# Altium schematic sheet Regulator3V3.SchDoc
size A; SheetNumber: 8; SheetTotal: 8
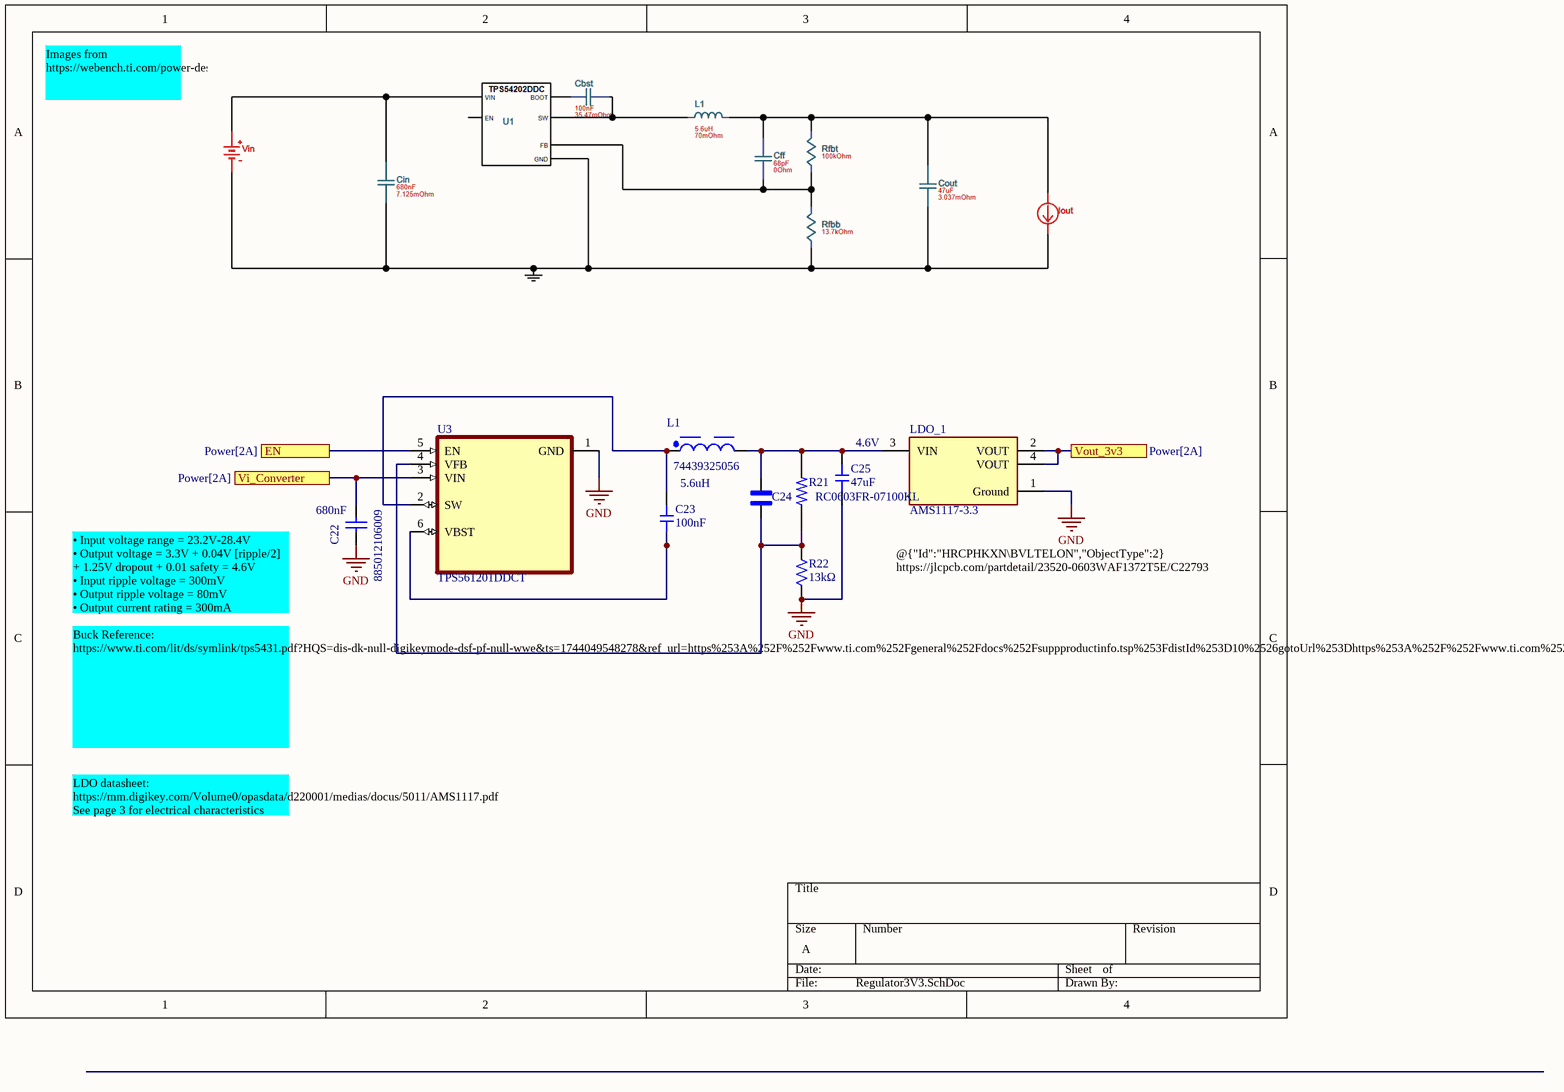
[diagram p0: Regulator3V3.SchDoc]

## Parts
C22  885012106009  Capacitance: 680nF  [WCAP-CSGP_0603_L1.6W0.8H0.8_Reflow]
C23  Capacitance: 100nF  [CAP-0402]  (hidden comment: CL05B104KO5NNNC)
C24  CGA1A2C0G1E680J030BA  [CAPC0603X33N]  (value not drawn)
C25  Capacitance: 47uF  [CAP-0805]  (hidden comment: CL21A476MQYNNNE)
L1  74439325056  Parameter 1: 5.6uH  [WE-XHMI_4040]
LDO_1  AMS1117-3.3  [FP-AMS1117-IPC_C]
R21  RC0603FR-07100KL  [RESC1607X60N]
R22  Resistance: 13kΩ  [RES-0603]  (hidden comment: 0603WAF1302T5E)
U3  TPS561201DDCT  [SOT95P280X110-6N]

## Ports
EN (see Power[2A]), Vi_Converter (see Power[2A]), Vout_3v3 (see Power[2A])

## Nets
GND: C22.1 C25.1 LDO_1.1(Ground) R22.1 U3.1(GND)
EN: U3.5(EN) ; port EN
Vi_Converter: C22.2 U3.3(VIN) ; port Vi_Converter
Vout_3v3: LDO_1.2(VOUT) LDO_1.4(VOUT) ; port Vout_3v3
NetC23_1: C23.1 U3.6(VBST)
NetC23_2: C23.2 L1.1 U3.2(SW)
NetC24_1: C24.1 R21.1 R22.2 U3.4(VFB)
NetC24_2: C24.2 C25.2 L1.2 LDO_1.3(VIN) R21.2

## Notes on the sheet
- Images from
  https://webench.ti.com/power-designer/switching-regulator?powerSupply=0
- 4.6V
- • Input voltage range = 23.2V-28.4V
  • Output voltage = 3.3V + 0.04V [ripple/2] + 1.25V dropout + 0.01 safety = 4.6V
  • Input ripple voltage = 300mV
  • Output ripple voltage = 80mV
  • Output current rating = 300mA
  • Operating frequency = 500kHz
- @{"Id":"HRCPHKXN\BVLTELON","ObjectType":2}
  https://jlcpcb.com/partdetail/23520-0603WAF1372T5E/C22793
- Buck Reference:
  https://www.ti.com/lit/ds/symlink/tps5431.pdf?HQS=dis-dk-null-digikeymode-dsf-pf-null-wwe&ts=1744049548278&ref_url=https%253A%252F%252Fwww.ti.com%252Fgeneral%252Fdocs%252Fsuppproductinfo.tsp%253FdistId%253D10%2526gotoUrl%253Dhttps%253A%252F%252Fwww.ti.com%252Flit%252Fgpn%252Ftps5431
- LDO datasheet:
  https://mm.digikey.com/Volume0/opasdata/d220001/medias/docus/5011/AMS1117.pdf
  See page 3 for electrical characteristics

## Library data of the parts
C22 = CMP-03913-53914714-2: Cap Cer 0.68UF 10V X5R 0603; Tolerance: 20%; Insulation Resistance: 200MΩ; Width: 800µm; Case Code (Imperial): 0603; Min Operating Temperature: -55°C; Mount: Surface Mount; Dielectric: X5R; Max Operating Temperature: 85°C; Length: 1.6mm; Height: 800µm; Thickness: 939.8µm; RoHS: Compliant; Packaging: Tape & Reel (TR); Voltage Rating (DC): 10V; Case Code (Metric): 1608; Case/Package: 0603; Voltage Rating: 10V
C23 = CL05B104KO5NNNC: Capacitor, Ceramic (MLCC), 100nF, ±10%, 16V, X7R, ±10%, SMD 0402; Manufacturer: Samsung Electro-Mechanics; Temperature Rating: -55°C ~ 125°C; Capacitance @ 1V DC Bias: 104.721nF; Capacitance @ 1.2V DC Bias: 104.598nF; Capacitance @ 1.35V DC Bias: 104.495nF; Capacitance @ 1.5V DC Bias: 104.372nF; Capacitance @ 1.8V DC Bias: 104.042nF; Capacitance @ 2.5V DC Bias: 102.634nF; Capacitance @ 3.3V DC Bias: 100.452nF; Capacitance @ 3.7V DC Bias: 99.160nF; Capacitance @ 4.2V DC Bias: 97.441nF; Capacitance @ 5V DC Bias: 94.577nF; Capacitance @ 9V DC Bias: 78.638nF; Capacitance @ 12V DC Bias: 66.291nF; Capacitance @ 15V DC Bias: 54.779nF; Impedance (0V Bias) @ 100Hz: 1.71E+04Ω; Impedance (0V Bias) @ 500Hz: 3.48E+03Ω; Impedance (0V Bias) @ 1kHz: 1.75E+03Ω; Impedance (0V Bias) @ 5kHz: 356Ω; Impedance (0V Bias) @ 10kHz: 179Ω; Impedance (0V Bias) @ 50kHz: 36.4Ω; Impedance (0V Bias) @ 100kHz: 18.3Ω; Impedance (0V Bias) @ 500kHz: 3.72Ω; Impedance (0V Bias) @ 1MHz: 1.87Ω; Impedance (0V Bias) @ 5MHz: 0.373Ω; Impedance (0V Bias) @ 10MHz: 0.175Ω; Impedance (0V Bias) @ 50MHz: 0.064Ω; Impedance (0V Bias) @ 100MHz: 0.122Ω; Impedance (0V Bias) @ 500MHz: 0.525Ω; Impedance (0V Bias) @ 1GHz: 0.97Ω; Impedance (0V Bias) @ 2GHz: 2.26Ω; Impedance (0V Bias) @ 5GHz: 4.75Ω; Impedance (16V Bias) @ 100Hz: 2.55E+04Ω; Impedance (16V Bias) @ 500Hz: 5.18E+03Ω; Impedance (16V Bias) @ 1kHz: 2.61E+03Ω; Impedance (16V Bias) @ 5kHz: 529Ω; Impedance (16V Bias) @ 10kHz: 266Ω; Impedance (16V Bias) @ 50kHz: 54Ω; Impedance (16V Bias) @ 100kHz: 27.2Ω; Impedance (16V Bias) @ 500kHz: 5.5Ω; Impedance (16V Bias) @ 1MHz: 2.76Ω; Impedance (16V Bias) @ 5MHz: 0.587Ω; Impedance (16V Bias) @ 10MHz: 0.277Ω; Impedance (16V Bias) @ 50MHz: 0.0412Ω; Impedance (16V Bias) @ 100MHz: 0.133Ω; Impedance (16V Bias) @ 500MHz: 0.524Ω; Impedance (16V Bias) @ 1GHz: 0.969Ω; Impedance (16V Bias) @ 2GHz: 2.25Ω; Impedance (16V Bias) @ 5GHz: 4.7Ω; Package Size: 0402; JLCPCB Basic Part: Yes; JLCPCB Part Number: C1525; Supplier 1: LCSC; Category: Capacitors - MLCC; Supplier Part Number 1: C1525; Manufacturer Part Number: CL05B104KO5NNNC; Tolerance: ±10%; Voltage Rating: 16V; Temperature Coefficient: X7R; RoHS: Yes; ComponentLink1Description: Datasheet; ComponentLink1URL: https://wmsc.lcsc.com/wmsc/upload/file/pdf/v2/lcsc/2304140030_Samsung-Electro-Mechanics-CL05B104KO5NNNC_C1525.pdf; ComponentLink2Description: JLCPCB Part URL; ComponentLink2URL: https://jlcpcb.com/partdetail/C1525; ComponentLink3Description: LCSC Part URL; ComponentLink3URL: https://lcsc.com/product-detail/Multilayer-Ceramic-Capacitors-MLCC---SMD-SMT_Samsung-Electro-Mechanics-Samsung-Electro-Mechanics-CL05B104KO5NNNC_C1525.html; ComponentLink4Description: Samsung Component Library; ComponentLink4URL: https://weblib.samsungsem.com/mlcc/mlcc-ec.do?partNumber=CL05B104KO5NNN
C24 = CGA1A2C0G1E680J030BA: 68 pF Â±5% 25V Ceramic Capacitor C0G, NP0 0201 (0603 Metric); MF: TDK; SnapEDA_Link: https://www.snapeda.com/parts/CGA1A2C0G1E680J030BA/TDK/view-part/?ref=snap; Package: 0603 Taiyo Yuden; Value: *; MP: CGA1A2C0G1E680J030BA; Check_prices: https://www.snapeda.com/parts/CGA1A2C0G1E680J030BA/TDK/view-part/?ref=eda
C25 = CL21A476MQYNNNE: Capacitor, Ceramic (MLCC), 47uF, ±20%, 6.3V, X5R, ±20%, SMD 0805; Manufacturer: Samsung Electro-Mechanics; Temperature Rating: -55°C ~ 85°C; Capacitance @ 1V DC Bias: 37.588uF; Capacitance @ 1.2V DC Bias: 35.744uF; Capacitance @ 1.35V DC Bias: 34.267uF; Capacitance @ 1.5V DC Bias: 32.775uF; Capacitance @ 1.8V DC Bias: 29.885uF; Capacitance @ 2.5V DC Bias: 24.262uF; Capacitance @ 3.3V DC Bias: 18.956uF; Capacitance @ 3.7V DC Bias: 16.988uF; Capacitance @ 4.2V DC Bias: 14.989uF; Capacitance @ 5V DC Bias: 12.411uF; Impedance (0V Bias) @ 100Hz: 51.8Ω; Impedance (0V Bias) @ 500Hz: 10.7Ω; Impedance (0V Bias) @ 1kHz: 5.39Ω; Impedance (0V Bias) @ 5kHz: 1.11Ω; Impedance (0V Bias) @ 10kHz: 0.559Ω; Impedance (0V Bias) @ 50kHz: 0.115Ω; Impedance (0V Bias) @ 100kHz: 0.0576Ω; Impedance (0V Bias) @ 500kHz: 0.00947Ω; Impedance (0V Bias) @ 1MHz: 0.00305Ω; Impedance (0V Bias) @ 5MHz: 0.0134Ω; Impedance (0V Bias) @ 10MHz: 0.0218Ω; Impedance (0V Bias) @ 50MHz: 0.0701Ω; Impedance (0V Bias) @ 100MHz: 0.113Ω; Impedance (0V Bias) @ 500MHz: 0.391Ω; Impedance (0V Bias) @ 1GHz: 0.706Ω; Impedance (0V Bias) @ 2GHz: 1.8Ω; Impedance (0V Bias) @ 5GHz: 2.67Ω; Package Size: 0805; JLCPCB Basic Part: Yes; JLCPCB Part Number: C16780; Supplier 1: LCSC; Category: Capacitors - MLCC; Supplier Part Number 1: C16780; Manufacturer Part Number: CL21A476MQYNNNE; Tolerance: ±20%; Voltage Rating: 6.3V; Temperature Coefficient: X5R; RoHS: Yes; ComponentLink1Description: Datasheet; ComponentLink1URL: https://wmsc.lcsc.com/wmsc/upload/file/pdf/v2/lcsc/2304140030_Samsung-Electro-Mechanics-CL21A476MQYNNNE_C16780.pdf; ComponentLink2Description: JLCPCB Part URL; ComponentLink2URL: https://jlcpcb.com/partdetail/C16780; ComponentLink3Description: LCSC Part URL; ComponentLink3URL: https://lcsc.com/product-detail/Multilayer-Ceramic-Capacitors-MLCC---SMD-SMT_Samsung-Electro-Mechanics-Samsung-Electro-Mechanics-CL21A476MQYNNNE_C16780.html; ComponentLink4Description: Samsung Component Library; ComponentLink4URL: https://weblib.samsungsem.com/mlcc/mlcc-ec.do?partNumber=CL21A476MQYNNN
L1 = CMP-03913-148605660-1: Power Inductor, 5.6UH, Shielded, 5.1A Rohs Compliant: Yes
LDO_1 = CMP-209535-000001-1: LDO Voltage Regulators 1A, 3.3V; Manufacturer: Advanced Monolithic Systems; Dropout Voltage: 1.1V; Output Type: Fixed; Nominal Supply Current: 5mA; Max Power Dissipation: 1.2W; Max Supply Voltage: 15V; Number Of Outputs: 1; Standoff Height: 0.64mm; Max Junction Temp: +125°C; Height: 1.8mm; Package: AMS1117; Device Class L2: Power Management ICs; ComponentLink2Description: Datasheet; ComponentLink2URL: http://www.advanced-monolithic.com/pdf/ds1117.pdf; Category: IC; RoHS: TRUE; Automotive: No; Device Class L1: Integrated Circuits (ICs); Output Current: 1A; Device Class L3: Voltage Regulators - Linear; Temperature: -40°C to +125°C; Output Voltage: 3.3V; Manufacturer Part Number: AMS1117-3.3; Temperature Range Low: -40°C; Octopart: https://octopart.com/ams1117-3.3-advanced+monolithic+systems-25899300; Lead Free: Yes; Ipc Land Pattern Name: SOT229P700X180-4; Temperature Range High: +125°C
R21 = RC0603FR-07100KL: 100 kOhms Â±1% 0.1W, 1/10W Chip Resistor 0603 (1608 Metric) Moisture Resistant Thick Film; MF: Yageo; SnapEDA_Link: https://www.snapeda.com/parts/RC0603FR-07100KL/Yageo/view-part/?ref=snap; Package: 0603 Yageo; Value: *; MP: RC0603FR-07100KL; Check_prices: https://www.snapeda.com/parts/RC0603FR-07100KL/Yageo/view-part/?ref=eda
R22 = 0603WAF1302T5E: Resistor, 13kΩ, ±1%, 100mW, 75V, ±100ppm/℃, -55℃~+155℃, SMD 0603; Manufacturer: Uniroyal; Supplier 1: LCSC; Manufacturer Part Number: 0603WAF1302T5E; Supplier Part Number 1: C22797; JLCPCB Part Number: C22797; Power Rating: 100mW; Category: Resistors; Package Size: 0603; JLCPCB Basic Part: Yes; Tolerance: ±1%; Voltage Rating: 75V; Temperature Coefficient: ±100ppm/℃; Temperature Rating: -55℃~+155℃; ComponentLink1Description: Datasheet; ComponentLink1URL: https://wmsc.lcsc.com/wmsc/upload/file/pdf/v2/lcsc/2206010130_UNI-ROYAL-Uniroyal-Elec-0603WAF1302T5E_C22797.pdf; ComponentLink2Description: JLCPCB Part URL; ComponentLink2URL: https://jlcpcb.com/partdetail/C22797
U3 = TPS561201DDCT: 4.5V to 17V Input, 1A Synchronous Step-Down Voltage Regulator in 6-pin SOT-23; MF: Texas Instruments; SnapEDA_Link: https://www.snapeda.com/parts/TPS561201DDCT/Texas+Instruments/view-part/?ref=snap; Package: SOT-23-THN-6 Texas Instruments; Value: *; MP: TPS561201DDCT; Check_prices: https://www.snapeda.com/parts/TPS561201DDCT/Texas+Instruments/view-part/?ref=eda